# EAGLE design BasculeD (EAGLE 6.3)
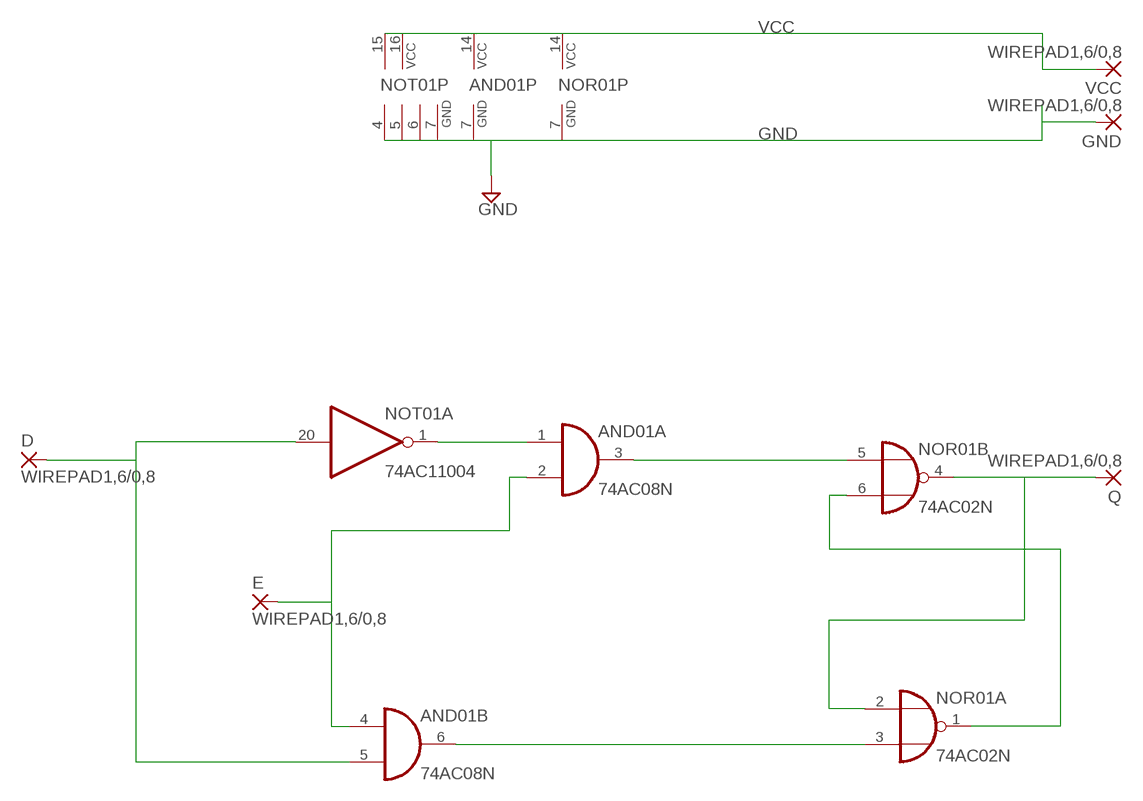
[diagram p0: schematic, sheet 1]

## Parts
AND01  74AC08N  [DIL14]
D  WIREPAD1,6/0,8  [1,6/0,8]
E  WIREPAD1,6/0,8  [1,6/0,8]
GND  WIREPAD1,6/0,8  [1,6/0,8]
NOR01  74AC02N  [DIL14]
NOT01  74AC11004  [DIL20]
Q  WIREPAD1,6/0,8  [1,6/0,8]
VCC  WIREPAD1,6/0,8  [1,6/0,8]

## Nets
GND: AND01.7(P:GND) GND.1(P) NOR01.7(P:GND) NOT01.4(P:GND) NOT01.5(P:GND) NOT01.6(P:GND) NOT01.7(P:GND)
N$1: AND01.1(A:I0) NOT01.1(A:O)
N$2: AND01.3(A:O) NOR01.5(B:I0)
N$3: NOR01.1(A:O) NOR01.6(B:I1)
N$4: AND01.6(B:O) NOR01.3(A:I1)
N$6: AND01.2(A:I1) AND01.4(B:I0) E.1(P)
N$7: AND01.5(B:I1) D.1(P) NOT01.20(A:I)
NOR01: NOR01.2(A:I0) NOR01.4(B:O) Q.1(P)
VCC: AND01.14(P:VCC) NOR01.14(P:VCC) NOT01.15(P:VCC) NOT01.16(P:VCC) VCC.1(P)
Unconnected: AND01.8(C:O) AND01.9(C:I0) AND01.10(C:I1) AND01.11(D:O) AND01.12(D:I0) AND01.13(D:I1) NOR01.8(C:I0) NOR01.9(C:I1) NOR01.10(C:O) NOR01.11(D:I0) NOR01.12(D:I1) NOR01.13(D:O) NOT01.2(B:O) NOT01.3(C:O) NOT01.8(D:O) NOT01.9(E:O) NOT01.10(F:O) NOT01.11(F:I) NOT01.12(E:I) NOT01.13(D:I) NOT01.18(C:I) NOT01.19(B:I)

## Library data of the parts
AND01 = 74xx-eu:74*08: Quad 2-input AND gate
D E GND Q VCC = wirepad:WIREPAD: Wire PAD connect wire on PCB
NOR01 = 74xx-eu:74*02: Quad 2-input NOR gate
NOT01 = 74ac-logic:74AC11004: Hex INVERTER

## Board
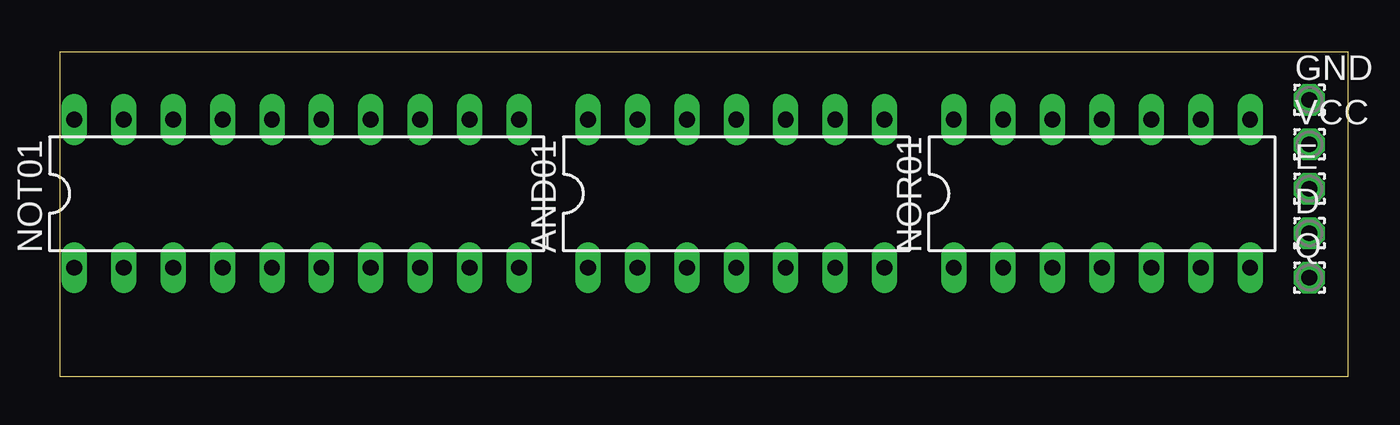
[diagram p1: board, top side]
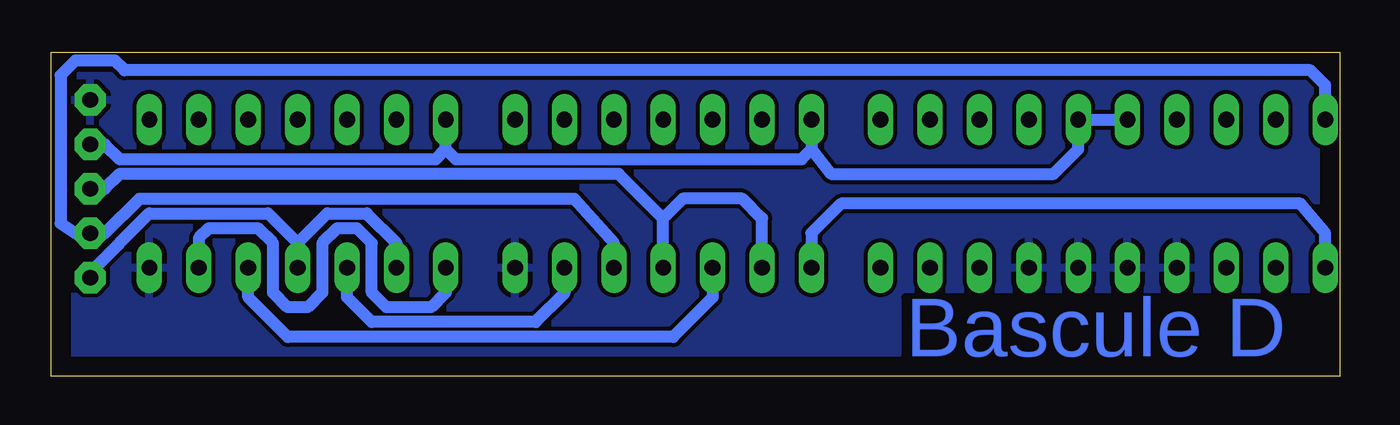
[diagram p2: board, bottom side, seen from below]

Size 66.27 x 16.69 mm. Coordinates in mm from the lower left corner, seen from the top.
Outline: 0,0 66.27,0 66.27,16.69 0,16.69 0,0
Copper layers (1*16): Top 0.035mm / dielectric 1.5mm / Bottom 0.035mm
Design rules "default": minimum track width 10mil, minimum drill 24mil, track to track 8mil, track to pad 8mil, pad to pad 8mil, via to via 8mil, smd to smd 8mil, copper to edge 40mil, drill to drill 8mil, minimum pad ring 10mil, minimum via ring 8mil, stop-mask expansion 4mil, vias tented up to drill 0mil, thermal gap 10mil

### Footprints (pad centres in the part's own frame; a part is rotated, then mirrored left to right if it is on the bottom)
DIL14 = drill 0.813 long: 1 -7.62,-3.81; 2 -5.08,-3.81; 3 -2.54,-3.81; 4 0,-3.81; 5 2.54,-3.81; 6 5.08,-3.81; 7 7.62,-3.81; 8 7.62,3.81; 9 5.08,3.81; 10 2.54,3.81; 11 0,3.81; 12 -2.54,3.81; 13 -5.08,3.81; 14 -7.62,3.81
1,6/0,8 = drill 0.813 pad 1.6 octagon: 1 0,0
DIL20 = drill 0.813 long: 1 -11.43,-3.81; 2 -8.89,-3.81; 3 -6.35,-3.81; 4 -3.81,-3.81; 5 -1.27,-3.81; 6 1.27,-3.81; 7 3.81,-3.81; 8 6.35,-3.81; 9 8.89,-3.81; 10 11.43,-3.81; 11 11.43,3.81; 12 8.89,3.81; 13 6.35,3.81; 14 3.81,3.81; 15 1.27,3.81; 16 -1.27,3.81; 17 -3.81,3.81; 18 -6.35,3.81; 19 -8.89,3.81; 20 -11.43,3.81

### Placement (x,y rotation side)
AND01  34.8,9.4 0 top
D  64.26,7.37 0 top
E  64.26,9.65 0 top
GND  64.26,14.22 0 top
NOR01  53.59,9.4 0 top
NOT01  12.19,9.4 0 top
Q  64.26,5.08 0 top
VCC  64.26,11.94 0 top

### Tracks (layer width: path | path; a pad name or v marks a point on that pad's centre or on a via)
GND
  pour Bottom: -65.53,88.14 117.35,88.14 122.43,88.14 122.43,-32.51 -61.72,-32.51 -61.72,-28.7 -65.53,-28.7
N$1
  Bottom 0.61: NOT01.1 0.76,7.37 2.03,8.89 25.65,8.89 27.18,7.37 AND01.1
N$2
  Bottom 0.61: 32.26,4.32 AND01.3 32.26,4.06 34.29,2.03 54.1,2.03 56.13,4.06 NOR01.5
N$3
  Bottom 0.61: NOR01.1 45.97,4.32 46.74,3.56 49.02,3.56 49.78,4.32 49.78,6.86 50.55,7.62 51.56,7.62 52.32,6.86 52.32,4.32 53.09,3.56 54.1,3.56 54.86,4.32 54.86,6.86 55.63,7.62 58.17,7.62 58.67,7.11 NOR01.6
N$4
  Bottom 0.61: AND01.6 39.88,4.27 41.36,2.79 49.78,2.79 51.05,4.06 NOR01.3
N$6
  Bottom 0.61: 34.8,8.13 37.08,10.41 62.74,10.41 63.5,9.65 E.1 | AND01.4 34.8,8.13 | AND01.2 29.72,8.13 30.73,9.14 33.78,9.14 34.8,8.13
N$7
  Bottom 0.61: NOT01.20 0.76,14.99 1.52,15.75 62.48,15.75 62.99,16.26 65.02,16.26 65.79,15.49 65.79,7.87 65.02,7.37 D.1 63.5,7.37 61.72,9.14 39.37,9.14 37.34,6.86 AND01.5
NOR01
  Bottom 0.406: NOR01.4 53.59,6.86
  Bottom 0.61: NOR01.2 48.51,6.86 50.04,8.38 52.07,8.38 53.59,6.86 55.12,8.38 61.21,8.38 64.26,5.33 Q.1
VCC
  Bottom 0.61: VCC.1 63.5,11.94 62.74,11.18 46.48,11.18 45.97,11.68 | 27.18,11.68 27.69,11.18 45.47,11.18 45.97,11.68 | AND01.14 27.18,11.68 | 27.18,11.68 26.16,10.41 14.73,10.41 13.46,11.68 NOT01.15 NOT01.16 | 45.97,11.68 NOR01.14

### Text on the board
Bottom: Bascule D